# EasyEDA Pro project Space_Hexapod.eprj, schematic Signal
Board Name: signal; Create Date: 2025-04-29
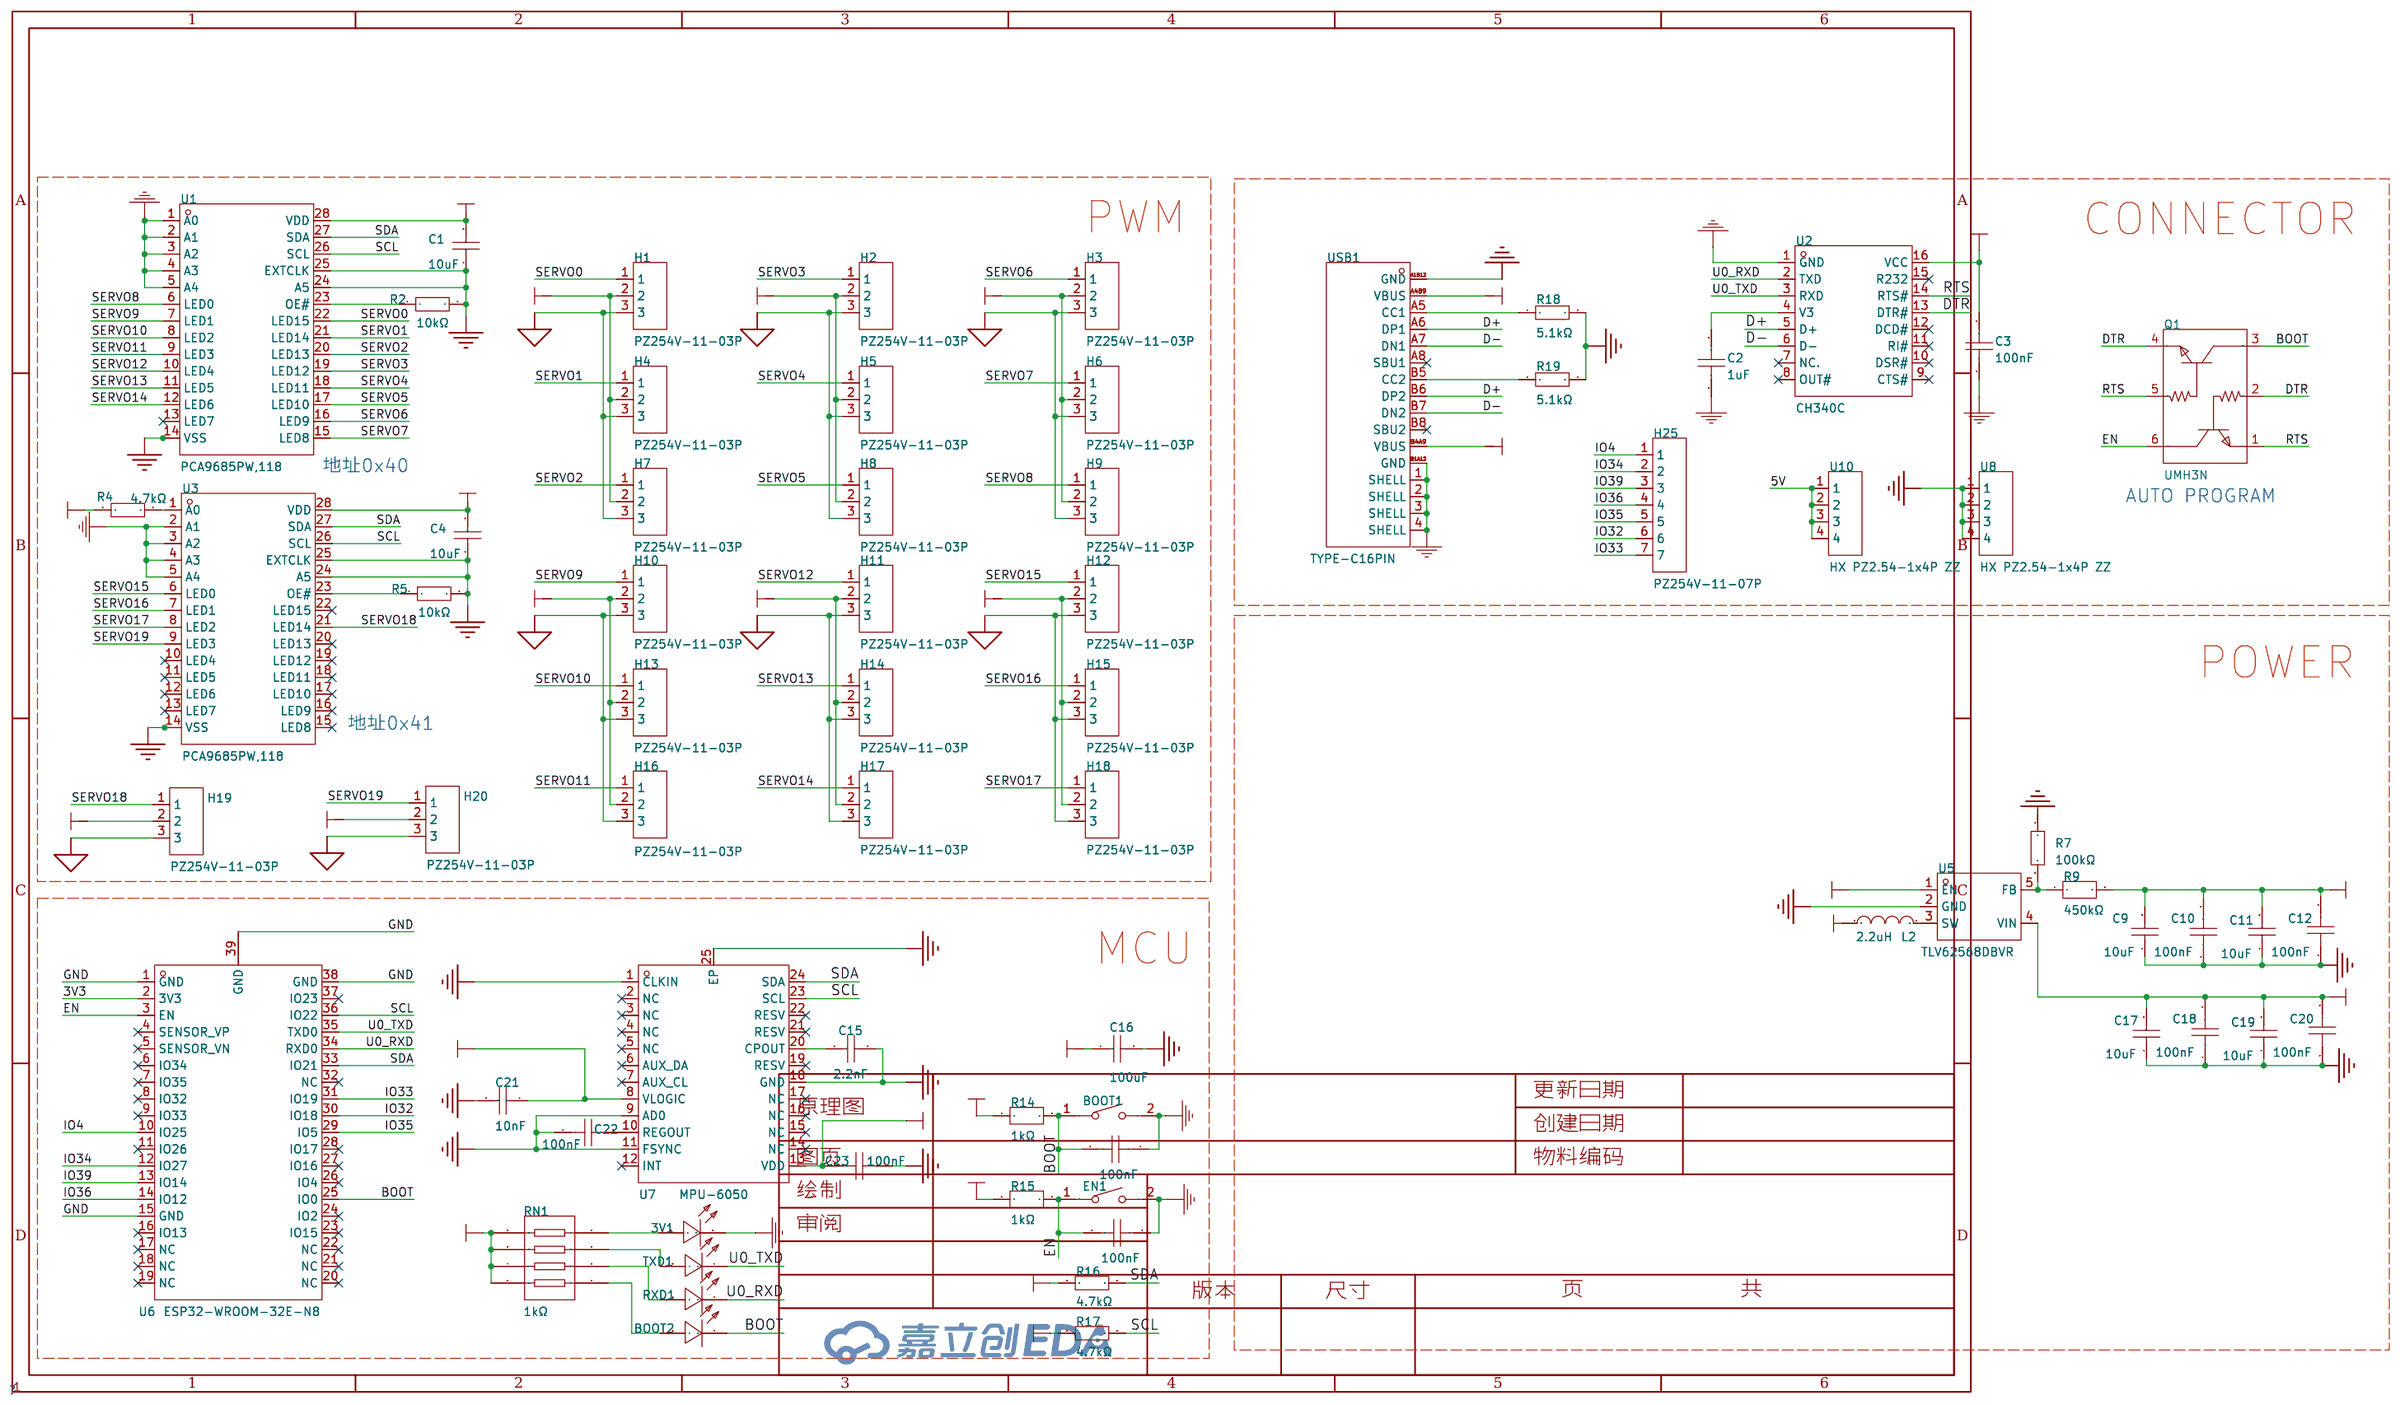
[diagram p1: schematic sheet]

## Parts
3V1  NCD0402G1  [LED0402-RD]
BOOT1  TS-1088-AR02016  [SW-SMD_L3.9-W3.0-P4.45]
BOOT2  NCD0402G1  [LED0402-RD]
C1  10uF  [C0402]
C2  1uF  [C0402]
C3  100nF  [C0402]
C4  10uF  [C0402]
C9  10uF  [C0402]
C10  100nF  [C0402]
C11  10uF  [C0402]
C12  100nF  [C0402]
C15  2.2nF  [C0402]
C16  100uF  [C1206]
C17  10uF  [C0402]
C18  100nF  [C0402]
C19  10uF  [C0402]
C20  100nF  [C0402]
C21  10nF  [C0402]
C22  100nF  [C0402]
C23  100nF  [C0402]
C24  100nF  [C0402]
C25  100nF  [C0402]
EN1  TS-1088-AR02016  [SW-SMD_L3.9-W3.0-P4.45]
H1  PZ254V-11-03P  [HDR-TH_3P-P2.54-V-M]
H2  PZ254V-11-03P  [HDR-TH_3P-P2.54-V-M]
H3  PZ254V-11-03P  [HDR-TH_3P-P2.54-V-M]
H4  PZ254V-11-03P  [HDR-TH_3P-P2.54-V-M]
H5  PZ254V-11-03P  [HDR-TH_3P-P2.54-V-M]
H6  PZ254V-11-03P  [HDR-TH_3P-P2.54-V-M]
H7  PZ254V-11-03P  [HDR-TH_3P-P2.54-V-M]
H8  PZ254V-11-03P  [HDR-TH_3P-P2.54-V-M]
H9  PZ254V-11-03P  [HDR-TH_3P-P2.54-V-M]
H10  PZ254V-11-03P  [HDR-TH_3P-P2.54-V-M]
H11  PZ254V-11-03P  [HDR-TH_3P-P2.54-V-M]
H12  PZ254V-11-03P  [HDR-TH_3P-P2.54-V-M]
H13  PZ254V-11-03P  [HDR-TH_3P-P2.54-V-M]
H14  PZ254V-11-03P  [HDR-TH_3P-P2.54-V-M]
H15  PZ254V-11-03P  [HDR-TH_3P-P2.54-V-M]
H16  PZ254V-11-03P  [HDR-TH_3P-P2.54-V-M]
H17  PZ254V-11-03P  [HDR-TH_3P-P2.54-V-M]
H18  PZ254V-11-03P  [HDR-TH_3P-P2.54-V-M]
H19  PZ254V-11-03P  [HDR-TH_3P-P2.54-V-M]
H20  PZ254V-11-03P  [HDR-TH_3P-P2.54-V-M]
H25  PZ254V-11-07P  [HDR-TH_7P-P2.54-V-M]
L2  2.2uH  [IND-SMD_L3.0-W3.0_FNR30XXS]
Q1  UMH3N  [SC-70-6_L2.2-W1.3-P0.65-LS2.1-BR]
R2  10kΩ  [R0402]
R4  4.7kΩ  [R0402]
R5  10kΩ  [R0402]
R7  100kΩ  [R0402]
R9  450kΩ  [R0402]
R14  1kΩ  [R0402]
R15  1kΩ  [R0402]
R16  4.7kΩ  [R0402]
R17  4.7kΩ  [R0402]
R18  5.1kΩ  [R0402]
R19  5.1kΩ  [R0402]
RN1  1kΩ  [RES-ARRAY-SMD_0603-8P-L3.2-W1.6-BL]
RXD1  NCD0402G1  [LED0402-RD]
TXD1  NCD0402G1  [LED0402-RD]
U1  PCA9685PW,118  [TSSOP-28_L9.7-W4.4-P0.65-LS6.4-TL]
U2  CH340C  [SOP-16_L10.0-W3.9-P1.27-LS6.0-BL]
U3  PCA9685PW,118  [TSSOP-28_L9.7-W4.4-P0.65-LS6.4-TL]
U5  TLV62568DBVR  [SOT-23-5_L3.0-W1.7-P0.95-LS2.8-BR]
U6  ESP32-WROOM-32E-N8  [WIFI-SMD_ESP32-WROOM-32E]
U7  MPU-6050  [QFN-24_L4.0-W4.0-P0.50-BL-EP2.7]
U8  HX PZ2.54-1x4P ZZ  [HDR-TH_4P-P2.54-V-M]
U10  HX PZ2.54-1x4P ZZ  [HDR-TH_4P-P2.54-V-M]
USB1  TYPE-C16PIN  [USB-C-SMD_TYPE-C16PIN]

## Library data of the parts
3V1 BOOT2 RXD1 TXD1 = NCD0402G1: Supplier Part: C130723; Manufacturer: 国星光电; Supplier Footprint: 0402; JLCPCB Part Class: 扩展库; Datasheet: https://atta.szlcsc.com/upload/public/pdf/source/20200820/C130723_D39B4171A1B8D8D2F39C1DC521C0922A.pdf; Supplier: LCSC; Emitted Color: 翠绿色; Forward Voltage (VF): 2.6V~3.6V; Power Dissipation: 72mW; Forward Current: 5mA; Dominant Wavelength: 515nm~530nm; Lens Color: 无色透明透镜; Luminous Intensity: 100mcd~270mcd; Viewing Angle: 130°; Operating Temperature: -30℃~+85℃
BOOT1 EN1 = TS-1088-AR02016: 电路结构:单刀单掷;按钮形状:圆形按钮;作用力:160gf;安装方式:立贴;开关长度:4mm;开关宽度:3mm;开关高度:2mm;带支架:不带;触点电流:50mA;额定电压(DC):12V;绝缘电阻:100MΩ;机械寿命:10万次;; LCSC Part Name: 4*3*2mm 立贴 轻触开关; Supplier Part: C720477; Manufacturer: XUNPU(讯普); Supplier Footprint: SMD; JLCPCB Part Class: 扩展库; Datasheet: https://atta.szlcsc.com/upload/public/pdf/source/20200810/C720475_60D09DD6C54279ADDB2DC25100F1CC11.pdf; Supplier: LCSC; Circuit: 单刀单掷; Actuator Style: 圆形按钮; Operating Force: 160gf; Mounting Style: 立贴; Switch Length: 4mm; Switch Width: 3mm; Switch Height: 2mm; Strike Gundam: 不带; Contact Current: 50mA; Voltage Rating (DC): 12V; Insulation Resistance: 100MΩ; Actuator/Cap Color: 黑色; Pin Style: SMD接片; Mechanical Life: 10万次; Operating Temperature: -30℃~+80℃
C1 C4 C9 C11 C17 C19 = CL05A106MQ5NUNC: 容值:10uF;精度:±20%;额定电压:6.3V;材质(温度系数):X5R;; LCSC Part Name: 10uF ±20% 6.3V; Supplier Part: C15525; Manufacturer: SAMSUNG(三星); Supplier Footprint: 0402; JLCPCB Part Class: 基础库; Datasheet: https://atta.szlcsc.com/upload/public/pdf/source/20220823/2B02EE04F8F211D38A52DCB16EB6BEBA.pdf; Supplier: LCSC; Tolerance: ±20%; Voltage Rated: 6.3V; Temperature Coefficient: X5R
C2 = GRM155R61H105KE05D: LCSC Part Name: 1uF ±10% 50V; Supplier Part: C1518208; Manufacturer: muRata(村田); Supplier Footprint: 0402; JLCPCB Part Class: 扩展库; Datasheet: https://atta.szlcsc.com/upload/public/pdf/source/20210607/3F03D47137F6EC7729AB4067EB2A6EB3.pdf; Supplier: LCSC; Tolerance: ±10%; Voltage Rated: 50V; Temperature Coefficient: X5R
C3 C22 C23 = CL05B104KB54PNC: LCSC Part Name: 100nF ±10% 50V; Supplier Part: C307331; Manufacturer: SAMSUNG(三星); Supplier Footprint: 0402; JLCPCB Part Class: 基础库; Datasheet: https://atta.szlcsc.com/upload/public/pdf/source/20160218/1457707763339.pdf; Supplier: LCSC; Tolerance: ±10%; Voltage Rated: 50V; Temperature Coefficient: X7R
C10 C12 C18 C20 C24 C25 = CC0402KRX7R7BB104: 容值:100nF;精度:±10%;额定电压:16V;材质(温度系数):X7R;; LCSC Part Name: 100nF ±10% 16V; Supplier Part: C60474; Manufacturer: YAGEO(国巨); Supplier Footprint: 0402; JLCPCB Part Class: 扩展库; Datasheet: https://atta.szlcsc.com/upload/public/pdf/source/20211223/9278FD768280B81DDBEF48FA36411A03.pdf; Supplier: LCSC; Tolerance: ±10%; Voltage Rated: 16V; Temperature Coefficient: X7R
C15 = CC0402KRX7R9BB222: LCSC Part Name: 2.2nF ±10% 50V; Supplier Part: C106861; Manufacturer: YAGEO(国巨); Supplier Footprint: 0402; JLCPCB Part Class: 扩展库; Datasheet: https://atta.szlcsc.com/upload/public/pdf/source/20170505/1493957848374.pdf; Supplier: LCSC; Tolerance: ±10%; Voltage Rated: 50V; Temperature Coefficient: X7R
C16 = CL31A107MQHNNNE: LCSC Part Name: 100uF ±20% 6.3V; Supplier Part: C15008; Manufacturer: SAMSUNG(三星); Supplier Footprint: 1206; JLCPCB Part Class: 基础库; Datasheet: https://atta.szlcsc.com/upload/public/pdf/source/20160218/1457707763339.pdf; Supplier: LCSC; Tolerance: ±20%; Voltage Rated: 6.3V; Temperature Coefficient: X5R
C21 = CL05B103KB5NNNC: LCSC Part Name: 10nF ±10% 50V; Supplier Part: C15195; Manufacturer: SAMSUNG(三星); Supplier Footprint: 0402; JLCPCB Part Class: 基础库; Datasheet: https://atta.szlcsc.com/upload/public/pdf/source/20160218/1457707763339.pdf; Supplier: LCSC; Tolerance: ±10%; Voltage Rated: 50V; Temperature Coefficient: X7R
H1-H20 = PZ254V-11-03P: LCSC Part Name: 间距:2.54mm 1x3P 直插 方针; Supplier Part: C2937625; Manufacturer: XFCN(兴飞); Supplier Footprint: 插件,P=2.54mm; JLCPCB Part Class: 扩展库; Datasheet: https://atta.szlcsc.com/upload/public/pdf/source/20200309/C492402_8335C3D49C4E4C618838D59BB1D024C1.pdf; Supplier: LCSC; Pin Structure: 1x3P; Pitch: 2.54mm; Circluar Pins/Square Pins: 方针; Mounting Type: 直插; Number of Rows: 单排; Number of Pins: 3P; Current Rating (Max): 3A; Voltage Rating (Max): 250V; Length of Mating Pin: 6mm; Insulation Height: 2.5mm; Length of End Connection Pin: 3mm; Operating Temperature Range: -40℃~+105℃; Color: 黑色
H25 = PZ254V-11-07P: LCSC Part Name: 1x7P 间距:2.54mm 方针 直插; Supplier Part: C492406; Manufacturer: XFCN(兴飞); Supplier Footprint: 插件,P=2.54mm; JLCPCB Part Class: 扩展库; Datasheet: https://atta.szlcsc.com/upload/public/pdf/source/20200309/C492406_654C533EE691117E22DD9F76C114C2D9.pdf; Supplier: LCSC; Pin Structure: 1x7P; Pitch: 2.54mm; Circluar Pins/Square Pins: 方针; Mounting Type: 直插; Number of Rows: 单排; Number of Pins: 7P; Length of Mating Pin: 6mm; Insulation Height: 2.5mm; Length of End Connection Pin: 3mm; Contact Material: 黄铜; Operating Temperature: -40℃~+105℃; Color: 黑色
L2 = FNR3015S2R2MT: LCSC Part Name: 2.2uH ±20% 2A; Supplier Part: C167747; Manufacturer: cjiang(长江微电); Supplier Footprint: SMD,3x3mm; JLCPCB Part Class: 扩展库; Datasheet: https://atta.szlcsc.com/upload/public/pdf/source/20190327/C167925_9EFF0AABC4CA629C2CC95961DBF7D39D.pdf; Supplier: LCSC; Tolerance: ±20%; Rated Current: 2A; Saturation Current (Isat): 2A; DC Resistance (DCR): 78mΩ
Q1 = UMH3N: LCSC Part Name: 耐压:50V 电流:100mA; Supplier Part: C62892; Manufacturer: CJ(江苏长电/长晶); Supplier Footprint: SC-70-6(SOT-363); JLCPCB Part Class: 扩展库; Datasheet: https://atta.szlcsc.com/upload/public/pdf/source/20151109/1457707575095.pdf; Supplier: LCSC; Collector-Emitter Breakdown Voltage (Vceo): 50V; Collector Current (Ic): 100mA; Power Dissipation (Pd): 150mW; DC Current Gain (hFE@Ic,Vce): 100@1mA,5V; Input Resistor: 6.11kΩ; Operating Temperature: -55℃~+150℃
R2 R5 = 0402WGF1002TCE: LCSC Part Name: 10kΩ ±1% 62.5mW 厚膜电阻; Supplier Part: C25744; Manufacturer: UNI-ROYAL(厚声); Supplier Footprint: 0402; JLCPCB Part Class: 基础库; Datasheet: https://atta.szlcsc.com/upload/public/pdf/source/20200306/C422600_1E6D84923E4A46A82E41ADD87F860B5C.pdf; Supplier: LCSC; Type: 厚膜电阻; Tolerance: ±1%; Power(Watts): 62.5mW; Overload Voltage (Max): 50V; Temperature Coefficient: ±100ppm/℃; Operating Temperature Range: -55℃~+155℃
R4 R16 R17 = 0402WGF4701TCE: LCSC Part Name: 4.7kΩ ±1% 62.5mW 厚膜电阻; Supplier Part: C25900; Manufacturer: UNI-ROYAL(厚声); Supplier Footprint: 0402; JLCPCB Part Class: 基础库; Datasheet: https://atta.szlcsc.com/upload/public/pdf/source/20200306/C422600_1E6D84923E4A46A82E41ADD87F860B5C.pdf; Supplier: LCSC; Type: 厚膜电阻; Tolerance: ±1%; Power(Watts): 62.5mW; Overload Voltage (Max): 50V; Temperature Coefficient: ±100ppm/℃; Operating Temperature Range: -55℃~+155℃
R7 = 0402WGF1003TCE: LCSC Part Name: 100kΩ ±1% 62.5mW 厚膜电阻; Supplier Part: C25741; Manufacturer: UNI-ROYAL(厚声); Supplier Footprint: 0402; JLCPCB Part Class: 基础库; Datasheet: https://atta.szlcsc.com/upload/public/pdf/source/20200306/C422600_1E6D84923E4A46A82E41ADD87F860B5C.pdf; Supplier: LCSC; Type: 厚膜电阻; Tolerance: ±1%; Power(Watts): 62.5mW; Overload Voltage (Max): 50V; Temperature Coefficient: ±100ppm/℃; Operating Temperature Range: -55℃~+155℃
R9 = FRC0402F4503TS: LCSC Part Name: 450kΩ ±1% 62.5mW 厚膜电阻; Supplier Part: C5159688; Manufacturer: FOJAN(富捷); Supplier Footprint: 0402; JLCPCB Part Class: 扩展库; Datasheet: https://atta.szlcsc.com/upload/public/pdf/source/20211221/925EC7D7225764EE0046F22065062C87.pdf; Supplier: LCSC; Type: 厚膜电阻; Tolerance: ±1%; Power(Watts): 62.5mW; Overload Voltage (Max): 50V; Temperature Coefficient: ±100ppm/℃
R14 R15 = RT0402BRD071KL: LCSC Part Name: 薄膜电阻 1kΩ ±0.1% 62.5mW; Supplier Part: C852624; Manufacturer: YAGEO(国巨); Supplier Footprint: 0402; JLCPCB Part Class: 扩展库; Datasheet: https://atta.szlcsc.com/upload/public/pdf/source/20210609/C852624_9EB141A274604F87C6BB037C8019D50A.pdf; Supplier: LCSC; Type: 薄膜电阻; Tolerance: ±0.1%; Power(Watts): 62.5mW; Overload Voltage (Max): 50V; Temperature Coefficient: ±25ppm/℃; Operating Temperature Range: -55℃~+155℃
R18 R19 = 0402WGF5101TCE: LCSC Part Name: 5.1kΩ ±1% 62.5mW 厚膜电阻; Supplier Part: C25905; Manufacturer: UNI-ROYAL(厚声); Supplier Footprint: 0402; JLCPCB Part Class: 基础库; Datasheet: https://atta.szlcsc.com/upload/public/pdf/source/20200306/C422600_1E6D84923E4A46A82E41ADD87F860B5C.pdf; Supplier: LCSC; Type: 厚膜电阻; Tolerance: ±1%; Power(Watts): 62.5mW; Overload Voltage (Max): 50V; Temperature Coefficient: ±100ppm/℃; Operating Temperature Range: -55℃~+155℃
RN1 = RC-ML08W102JT: LCSC Part Name: 1kΩ ±5%; Supplier Part: C160614; Manufacturer: FH(风华); Supplier Footprint: 0603x4; JLCPCB Part Class: 扩展库; Datasheet: https://atta.szlcsc.com/upload/public/pdf/source/20140224/1457706855019.pdf; Supplier: LCSC; Number of Resistors: 4; Tolerance: ±5%; Power(Watts): 62.5mW; Temperature Coefficient: ±100ppm/℃; Number of Pins: 8
U1 U3 = PCA9685PW,118: Supplier Part: C2678753; Manufacturer: NXP(恩智浦); Supplier Footprint: TSSOP-28; JLCPCB Part Class: 扩展库; Datasheet: https://atta.szlcsc.com/upload/public/pdf/source/20170908/C92206_1504870161626958140.pdf; Supplier: LCSC; Input Voltage: 2.3V~5.5V; Switch Frequency: 100kHz~1MHz; Channels: 16; Output Voltage: 5.5V; Output Current: 25mA; Dimming: PWM; Operating temperature: -40℃~+85℃
U2 = CH340C: LCSC Part Name: CH340C USB转串口芯片 CH340; Supplier Part: C84681; Manufacturer: WCH(南京沁恒); Supplier Footprint: SOP-16; JLCPCB Part Class: 扩展库; Datasheet: https://atta.szlcsc.com/upload/public/pdf/source/20240619/63986D8440D4E5267A77ACD891CC4DE3.pdf; Supplier: LCSC; Applications Function: 收发器; Protocol: USB 2.0; Supply Voltage: 3.3V；5V; Data Rate: 2Mbps
U5 = TLV62568DBVR: LCSC Part Name: 1A高效同步降压转换器; Supplier Part: C163219; Manufacturer: TI(德州仪器); Supplier Footprint: SOT-23-5; JLCPCB Part Class: 扩展库; Datasheet: https://www.ti.com/cn/lit/gpn/tlv62568; Supplier: LCSC; Function: 降压型; Output Type: 可调; Input Voltage: 2.5V~5.5V; Output Voltage: 600mV~5.5V; Output Current: 1A; Switching Frequency: 1.5MHz; Operating Temperature: -40℃~+125℃@(TJ); Synchronous Rectification: 是; Number of Outputs: 1; Topology: 降压式; Switch tube (built-in/external): 内置
U6 = ESP32-WROOM-32E-N8: LCSC Part Name: 通用型Wi-Fi+BT+BLE MCU模组; Supplier Part: C701342; Manufacturer: ESPRESSIF(乐鑫); Supplier Footprint: SMD,18x25.5mm; JLCPCB Part Class: 扩展库; Datasheet: https://atta.szlcsc.com/upload/public/pdf/source/20240307/DEBA00FAE5BA634F0D73085E4F214E93.pdf; Supplier: LCSC
U7 = MPU-6050: Supplier Part: C24112; Manufacturer: TDK InvenSense(应美盛); Supplier Footprint: QFN-24-EP(4x4); JLCPCB Part Class: 扩展库; Datasheet: https://atta.szlcsc.com/upload/public/pdf/source/20140425/1457707046159.pdf; Supplier: LCSC; Sensor Type: 加速度计陀螺仪; Operating Temperature: -40℃~+85℃
U8 U10 = HX PZ2.54-1x4P ZZ: LCSC Part Name: 1x4P 间距:2.54mm 方针 直插; Supplier Part: C32713270; Manufacturer: hanxia(韩下); Supplier Footprint: 插件,P=2.54mm; JLCPCB Part Class: 扩展库; Datasheet: https://atta.szlcsc.com/upload/public/pdf/source/20240723/FF61E847292D749BB7D110157DA5A2B5.pdf; Supplier: LCSC; Pin Structure: 1x4P; Pitch: 2.54mm; Circluar Pins/Square Pins: 方针; Mounting Type: 直插; Number of Rows: 单排; Number of Pins: 4P; Current Rating: 3A; Length of Mating Pin: 6mm; Insulation Height: 2.5mm; Length of End Connection Pin: 3mm; Contact Material: 黄铜; Contact Plating: 金; Operating Temperature: -40℃~+105℃; Color: 黑色
USB1 = TYPE-C16PIN: LCSC Part Name: Type-C 母 卧贴; Supplier Part: C393939; Manufacturer: SHOU HAN(首韩); Supplier Footprint: SMD; JLCPCB Part Class: 扩展库; Datasheet: https://atta.szlcsc.com/upload/public/pdf/source/20190521/C393939_7B9043D4CF1026AF443AB60D91FBCD5C.pdf; Supplier: LCSC; Connector Type: Type-C; Standard: USB 3.1; Gender: 母; Mounting Style: 卧贴; Number of Contacts: 16P; Number of Ports: 1; Current Rating - Power (Max): 3A; Operating Temperature Range: -40℃~+85℃; Rated Voltage (Max): 30V; Connect-Disconnect Life: 1万次; Core Colour: 黑色

## Nets
3V3: C1.2 C3.2 C4.2 C9.2 C10.2 C11.2 C12.2 C16.1 C21.1 C23.2 L2.1 R4.1 R9.2 R14.1 R15.1 R16.1 R17.1 RN1.5 RN1.6 RN1.7 RN1.8 U1.28(VDD) U2.16(VCC) U3.28(VDD) U6.2(3V3) U7.8(VLOGIC) U7.13(VDD)
5V: C17.2 C18.2 C19.2 C20.2 H1.2 H2.2 H3.2 H4.2 H5.2 H6.2 H7.2 H8.2 H9.2 H10.2 H11.2 H12.2 H13.2 H14.2 H15.2 H16.2 H17.2 H18.2 H19.2 H20.2 U5.1(EN) U5.4(VIN) U10.1 U10.2 U10.3 U10.4 USB1.A4B9(VBUS) USB1.B4A9(VBUS)
GND: 3V1.1(K) BOOT1.2 C1.1 C2.1 C3.1 C4.1 C9.1 C10.1 C11.1 C12.1 C15.2 C16.2 C17.1 C18.1 C19.1 C20.1 C21.2 C22.1 C23.1 C24.1 C25.1 EN1.2 H1.3 H2.3 H3.3 H4.3 H5.3 H6.3 H7.3 H8.3 H9.3 H10.3 H11.3 H12.3 H13.3 H14.3 H15.3 H16.3 H17.3 H18.3 H19.3 H20.3 R2.2 R5.2 R7.1 R18.2 R19.2 U1.1(A0) U1.2(A1) U1.3(A2) U1.4(A3) U1.5(A4) U1.14(VSS) U1.24(A5) U1.25(EXTCLK) U2.1(GND) U3.2(A1) U3.3(A2) U3.4(A3) U3.5(A4) U3.14(VSS) U3.24(A5) U3.25(EXTCLK) U5.2(GND) U6.1(GND) U6.15(GND) U6.38(GND) U6.39(GND) U7.1(CLKIN) U7.9(AD0) U7.11(FSYNC) U7.18(GND) U7.25(EP) U8.1 U8.2 U8.3 U8.4 USB1.1(SHELL) USB1.2(SHELL) USB1.3(SHELL) USB1.4(SHELL) USB1.A1B12(GND) USB1.B1A12(GND)
BOOT: BOOT1.1 BOOT2.1(K) C24.2 Q1.3(C) R14.2 U6.25(IO0)
D+: U2.5(D+) USB1.A6(DP1) USB1.B6(DP2)
D-: U2.6(D-) USB1.A7(DN1) USB1.B7(DN2)
DTR: Q1.2(B) Q1.4(E) U2.13(DTR#)
EN: C25.2 EN1.1 Q1.6(C) R15.2 U6.3(EN)
IO4: H25.1 U6.10(IO25)
IO32: H25.6 U6.30(IO18)
IO33: H25.7 U6.31(IO19)
IO34: H25.2 U6.12(IO27)
IO35: H25.5 U6.29(IO5)
IO36: H25.4 U6.14(IO12)
IO39: H25.3 U6.13(IO14)
RTS: Q1.1(E) Q1.5(B) U2.14(RTS#)
SCL: R17.2 U1.26(SCL) U3.26(SCL) U6.36(IO22) U7.23(SCL)
SDA: R16.2 U1.27(SDA) U3.27(SDA) U6.33(IO21) U7.24(SDA)
SERVO0: H1.1 U1.22(LED15)
SERVO1: H4.1 U1.21(LED14)
SERVO2: H7.1 U1.20(LED13)
SERVO3: H2.1 U1.19(LED12)
SERVO4: H5.1 U1.18(LED11)
SERVO5: H8.1 U1.17(LED10)
SERVO6: H3.1 U1.16(LED9)
SERVO7: H6.1 U1.15(LED8)
SERVO8: H9.1 U1.6(LED0)
SERVO9: H10.1 U1.7(LED1)
SERVO10: H13.1 U1.8(LED2)
SERVO11: H16.1 U1.9(LED3)
SERVO12: H11.1 U1.10(LED4)
SERVO13: H14.1 U1.11(LED5)
SERVO14: H17.1 U1.12(LED6)
SERVO15: H12.1 U3.6(LED0)
SERVO16: H15.1 U3.7(LED1)
SERVO17: H18.1 U3.8(LED2)
SERVO18: H19.1 U3.21(LED14)
SERVO19: H20.1 U3.9(LED3)
U0_RXD: RXD1.1(K) U2.2(TXD) U6.34(RXD0)
U0_TXD: TXD1.1(K) U2.3(RXD) U6.35(TXD0)
$3N156124: C15.1 U7.20(CPOUT)
$3N156137: C22.2 U7.10(REGOUT)
$3N156225: R2.1 U1.23(OE#)
$3N156237: R19.1 USB1.B5(CC2)
$3N156249: C2.2 U2.4(V3)
$3N156259: R18.1 USB1.A5(CC1)
$3N156261: R5.1 U3.23(OE#)
$3N160361: R7.2 R9.1 U5.5(FB)
$3N160490: L2.2 U5.3(SW)
$3N161793: R4.2 U3.1(A0)
$3N172933: 3V1.2(A) RN1.4
$3N172966: RN1.3 TXD1.2(A)
$3N172969: BOOT2.2(A) RN1.1
$3N173003: RN1.2 RXD1.2(A)

Not connected (* = marked no-connect by the designer): U1 13(LED7)*; U2 7(NC.)* 8(OUT#)* 9(CTS#)* 10(DSR#)* 11(RI#)* 12(DCD#)* 15(R232)*; U3 10(LED4)* 11(LED5)* 12(LED6)* 13(LED7)* 15(LED8)* 16(LED9)* 17(LED10)* 18(LED11)* 19(LED12)* 20(LED13)* 22(LED15)*; U6 4(SENSOR_VP)* 5(SENSOR_VN)* 6(IO34)* 7(IO35)* 8(IO32)* 9(IO33)* 11(IO26)* 16(IO13)* 17(NC)* 18(NC)* 19(NC)* 20(NC)* 21(NC)* 22(NC)* 23(IO15)* 24(IO2)* 26(IO4)* 27(IO16)* 28(IO17)* 32(NC)* 37(IO23)*; U7 2(NC)* 3(NC)* 4(NC)* 5(NC)* 6(AUX_DA)* 7(AUX_CL)* 12(INT)* 14(NC)* 15(NC)* 16(NC)* 17(NC)* 19(RESV)* 21(RESV)* 22(RESV)*; USB1 A8(SBU1)* B8(SBU2)*

## Notes on the sheet
- PWM
- CONNECTOR
- 地址0x40
- AUTO PROGRAM
- POWER
- 地址0x41
- MCU
